# EAGLE design main (EAGLE 6.6.0)
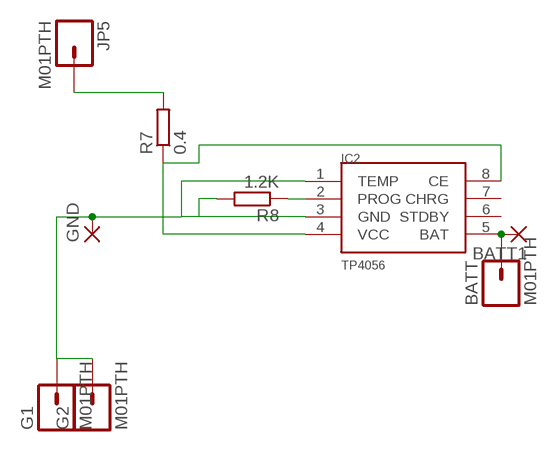
[diagram p0: schematic, sheet 1]

## Parts
BATT  M01PTH  [1X01]
BATT1  SMD2  [SMD1,27-2,54]
G1  M01PTH  [1X01]
G2  M01PTH  [1X01]
GND  SMD2  [SMD1,27-2,54]
IC2  TP4056  [SOP-8]
JP5  M01PTH  [1X01]
R7  0.4  R-EU_M0805  [M0805]
R8  1.2K  R-EU_R0603  [R0603]

## Nets
N$4: BATT1.1(P) BATT.1 IC2.5(BAT)
N$7: G1.1 G2.1 GND.1(P) IC2.1(TEMP) IC2.3(GND) R8.2
N$8: JP5.1 R7.2
N$13: IC2.4(VCC) IC2.8(CE) R7.1
N$14: IC2.2(PROG) R8.1
Unconnected: IC2.6(STDBY) IC2.7(CHRG)

## Library data of the parts
BATT G1 G2 JP5 = SparkFun-Connectors:M01: Header 1 Standard 1-pin 0.1" header. Use with straight break away headers (SKU : PRT-00116), right angle break away headers (PRT-00553), swiss pins (PRT-00743), machine pins (PRT-00117), and female headers (PRT-00115).
BATT1 GND = wirepad:SMD2: SMD PAD
IC2 = TP4056:TP4056
R7 R8 = rcl:R-EU_: RESISTOR, European symbol

## Board
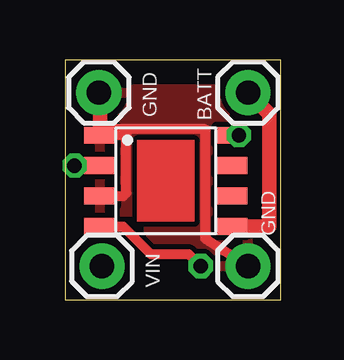
[diagram p1: board, top side]
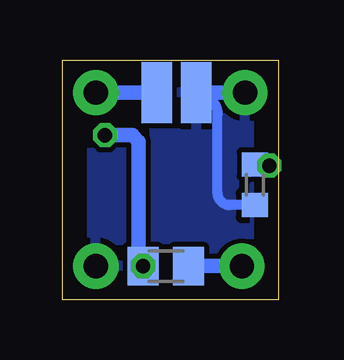
[diagram p2: board, bottom side, seen from below]

Size 9 x 10 mm. Coordinates in mm from the lower left corner, seen from the top.
Outline: 0,0 9,0 9,10 0,10 0,0
Copper layers (1*16): Top 0.035mm / dielectric 1.5mm / Bottom 0.035mm
Design rules "default": minimum track width 10mil, minimum drill 24mil, track to track 8mil, track to pad 8mil, pad to pad 8mil, via to via 8mil, smd to smd 8mil, copper to edge 40mil, drill to drill 8mil, minimum pad ring 10mil, minimum via ring 8mil, stop-mask expansion 4mil, vias tented up to drill 0mil, thermal gap 10mil
tKeepout: area 3,3.3 to 5.3,6.6; area 3,3.3 to 5.3,6.6

### Footprints (pad centres in the part's own frame; a part is rotated, then mirrored left to right if it is on the bottom)
1X01 = drill 1.016 pad 1.88: 1 0,0
SMD1,27-2,54 = smd 1.27 x 2.54: 1 0,0
SOP-8 = smd 1.3 x 0.7: 1 -2.75,1.905; 2 -2.75,0.635; 3 -2.75,-0.635; 4 -2.75,-1.905; 5 2.75,-1.905; 6 2.75,-0.635; 7 2.75,0.635; 8 2.75,1.905
M0805 = smd 1.3 x 1.6: 1 -0.95,0; 2 0.95,0
R0603 = smd 1 x 1.1: 1 -0.85,0; 2 0.85,0

### Placement (x,y rotation side)
BATT  7.62,8.64 0 top
BATT1  5.08,8.64 0 bottom
G1  7.62,1.4 0 top
G2  1.4,8.64 0 top
GND  3.43,8.64 0 bottom
IC2  4.19,4.95 0 top
JP5  1.52,1.4 0 top
R7  4.7,1.4 0 bottom
R8  0.98,4.79 270 bottom

### Tracks (layer width: path | path; a pad name or v marks a point on that pad's centre or on a via)
N$4
  Top 0.61: IC2.5 8.51,3.05 8.51,7.75 BATT.1
  Bottom 0.61: BATT1.1 BATT.1
N$7
  Top 0.406: IC2.3 2.41,4.32 2.54,4.45 2.54,6.86 IC2.1 arc-90 1.7,7.11 5.84,7.11 5.84,2.54 G1.1
  Top 0.61: G2.1 1.44,8.64 IC2.1
  Bottom 0.406: R8.2 2.04,3.94 arc90 2.54,4.45 2.54,7.75 arc-90 GND.1
  Bottom 0.61: GND.1 G2.1
  pour Top: -1.27,10.79 10.16,10.79 10.16,-1.27 -1.27,-1.27
  pour Bottom: -0.64,10.16 9.53,10.16 9.53,-0.64 -0.64,-0.64
N$8
  Bottom 0.61: JP5.1 R7.2
N$13  (via drill 0.6)
  Top 0.406: IC2.4 2.41,3.05 3.56,1.91 5.14,1.91 R7.1
  Top 0.61: IC2.8 v7.24,6.86
  Bottom 0.406: R7.1 5.65,1.71 5.84,1.91
  Bottom 0.61: v7.24,6.86 6.1,6.86 5.84,6.6 5.84,1.91 5.84,1.59 R7.1
  other vias: 5.65,1.4
N$14  (via drill 0.6)
  Top 0.61: v0.38,5.59 IC2.2
  Bottom 0.61: R8.1 0.44,5.64 v0.38,5.59

### Text on the board
tPlace: GND | BATT | GND | VIN